# EAGLE design ledbar (EAGLE 5.11)
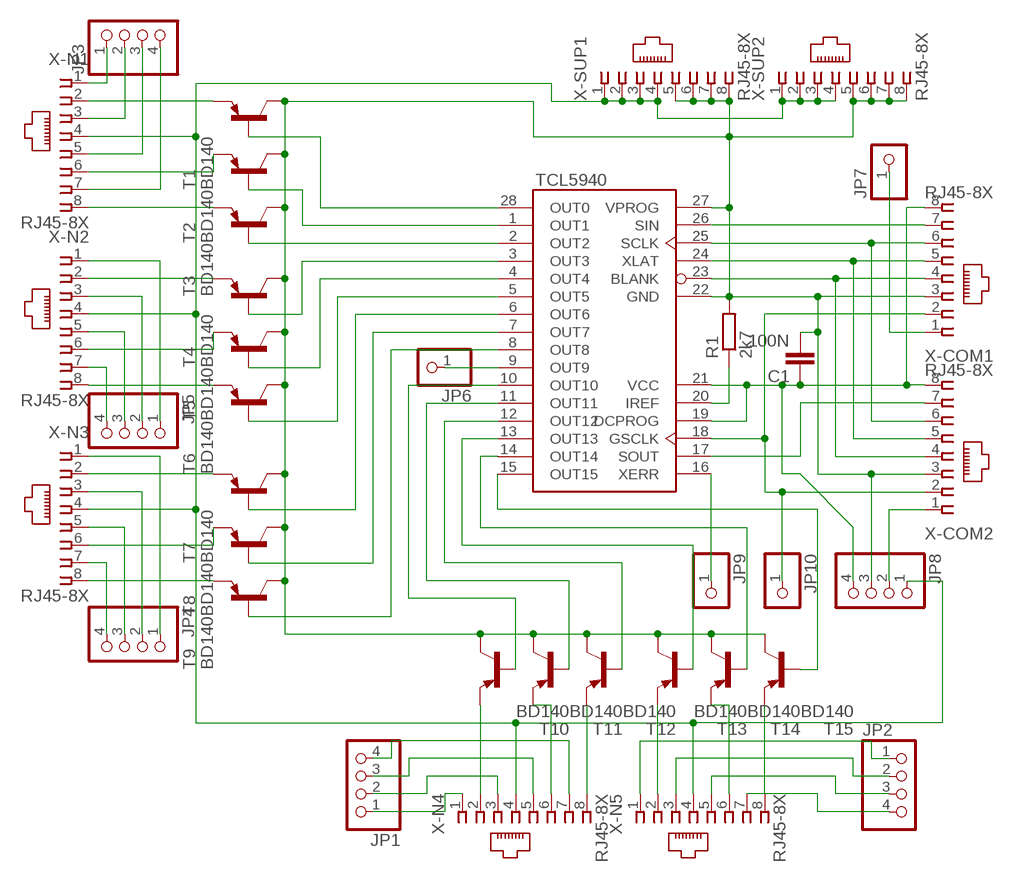
[diagram p0: schematic, sheet 1]

## Parts
C1  100N  C2.5/2  [C2.5-2]
IC1  TCL5940  [DIP28]
JP1  PINHD-1X4  [1X04]
JP2  PINHD-1X4  [1X04]
JP3  PINHD-1X4  [1X04]
JP4  PINHD-1X4  [1X04]
JP5  PINHD-1X4  [1X04]
JP6  PINHD-1X1  [1X01]
JP7  PINHD-1X1  [1X01]
JP8  PINHD-1X4  [1X04]
JP9  PINHD-1X1  [1X01]
JP10  PINHD-1X1  [1X01]
R1  2k7  R-EU_0204/7  [0204/7]
T1  BD140  -PNP-TO126V  [TO126V]
T2  BD140  -PNP-TO126V  [TO126V]
T3  BD140  -PNP-TO126V  [TO126V]
T4  BD140  -PNP-TO126V  [TO126V]
T5  BD140  -PNP-TO126V  [TO126V]
T6  BD140  -PNP-TO126V  [TO126V]
T7  BD140  -PNP-TO126V  [TO126V]
T8  BD140  -PNP-TO126V  [TO126V]
T9  BD140  -PNP-TO126V  [TO126V]
T10  BD140  -PNP-TO126V  [TO126V]
T11  BD140  -PNP-TO126V  [TO126V]
T12  BD140  -PNP-TO126V  [TO126V]
T13  BD140  -PNP-TO126V  [TO126V]
T14  BD140  -PNP-TO126V  [TO126V]
T15  BD140  -PNP-TO126V  [TO126V]
X-COM1  RJ45-8X  [RJ45-NO-SHIELD]
X-COM2  RJ45-8X  [RJ45-NO-SHIELD]
X-N1  RJ45-8X  [RJ45-NO-SHIELD]
X-N2  RJ45-8X  [RJ45-NO-SHIELD]
X-N3  RJ45-8X  [RJ45-NO-SHIELD]
X-N4  RJ45-8X  [RJ45-NO-SHIELD]
X-N5  RJ45-8X  [RJ45-NO-SHIELD]
X-SUP1  RJ45-8X  [RJ45-NO-SHIELD]
X-SUP2  RJ45-8X  [RJ45-NO-SHIELD]

## Nets
GND: C1.2 IC1.22(GND) IC1.27(VPROG) JP8.3 R1.2 T1.2(C) T2.2(C) T3.2(C) T4.2(C) T5.2(C) T6.2(C) T7.2(C) T8.2(C) T9.2(C) T10.2(C) T11.2(C) T12.2(C) T13.2(C) T14.2(C) T15.2(C) X-COM1.3 X-COM2.3 X-SUP1.5 X-SUP1.6 X-SUP1.7 X-SUP1.8 X-SUP2.5 X-SUP2.6 X-SUP2.7 X-SUP2.8
N$1: JP8.1 X-N1.4 X-N2.4 X-N3.4 X-N4.4 X-N5.4 X-SUP1.1 X-SUP1.2 X-SUP1.3 X-SUP1.4 X-SUP2.1 X-SUP2.2 X-SUP2.3 X-SUP2.4
N$2: IC1.28(OUT0) T1.3(B)
N$3: T1.1(E) X-N1.2
N$4: IC1.1(OUT1) T2.3(B)
N$5: IC1.26(SIN) X-COM1.7
N$6: IC1.2(OUT2) T3.3(B)
N$7: IC1.20(IREF) R1.1
N$8: IC1.25(SCLK) X-COM1.6 X-COM2.6
N$9: IC1.24(XLAT) X-COM1.5 X-COM2.5
N$10: IC1.23(BLANK) X-COM1.4 X-COM2.4
N$11: IC1.18(GSCLK) JP10.1 X-COM1.2 X-COM2.2
N$12: C1.1 IC1.19(DCPROG) IC1.21(VCC) JP8.4 X-COM1.8 X-COM2.8
N$13: IC1.3(OUT3) T4.3(B)
N$14: IC1.17(SOUT) X-COM2.7
N$15: T6.1(E) X-N2.8
N$16: T9.1(E) X-N3.8
N$17: IC1.4(OUT4) T5.3(B)
N$18: T10.1(E) X-N4.2
N$19: JP8.2 X-COM2.1
N$20: T4.1(E) X-N2.2
N$21: IC1.5(OUT5) T6.3(B)
N$22: JP1.1 X-N4.1
N$23: JP1.2 X-N4.3
N$24: T7.1(E) X-N3.2
N$25: IC1.6(OUT6) T7.3(B)
N$26: IC1.7(OUT7) T8.3(B)
N$27: IC1.8(OUT8) T9.3(B)
N$28: T3.1(E) X-N1.8
N$29: JP1.3 X-N4.5
N$30: JP1.4 X-N4.7
N$31: T12.1(E) X-N4.8
N$32: T2.1(E) X-N1.6
N$33: JP2.4 X-N5.7
N$34: JP2.3 X-N5.5
N$35: T15.1(E) X-N5.8
N$36: IC1.15(OUT15) T15.3(B)
N$37: IC1.14(OUT14) T14.3(B)
N$38: IC1.13(OUT13) T13.3(B)
N$39: IC1.12(OUT12) T12.3(B)
N$40: IC1.11(OUT11) T11.3(B)
N$41: IC1.10(OUT10) T10.3(B)
N$42: JP2.2 X-N5.3
N$43: T5.1(E) X-N2.6
N$44: T14.1(E) X-N5.6
N$45: JP4.1 X-N3.1
N$46: JP4.2 X-N3.3
N$47: T8.1(E) X-N3.6
N$48: JP4.3 X-N3.5
N$49: JP4.4 X-N3.7
N$50: T11.1(E) X-N4.6
N$51: JP5.1 X-N2.1
N$52: JP5.2 X-N2.3
N$53: T13.1(E) X-N5.2
N$54: JP5.3 X-N2.5
N$55: JP5.4 X-N2.7
N$56: JP3.1 X-N1.1
N$57: JP3.2 X-N1.3
N$58: JP3.3 X-N1.5
N$59: JP3.4 X-N1.7
N$60: JP2.1 X-N5.1
N$61: IC1.9(OUT9) JP6.1
N$62: JP7.1 X-COM1.1
N$63: IC1.16(XERR) JP9.1

## Library data of the parts
C1 = capacitor-wima:C: CAPACITOR naming: grid - package width
IC1 = tcl5940:TCL5940: 16-Channel 12-Bit LED Driver
JP1-JP5 JP8 = pinhead:PINHD-1X4: PIN HEADER
JP6 JP7 JP9 JP10 = pinhead:PINHD-1X1: PIN HEADER
R1 = resistor:R-EU_: RESISTOR, European symbol
T1-T15 = transistor:*-PNP-: PNP Transistror
X-COM1 X-COM2 X-N1-X-N5 X-SUP1 X-SUP2 = con-tycoelectronics:RJ45: CORCOM Modular RJ Jacks No Shield Source: www.tycoelectronics.com .. ENG_DS_1654001_1099_RJ_L_0507.pdf

## Board
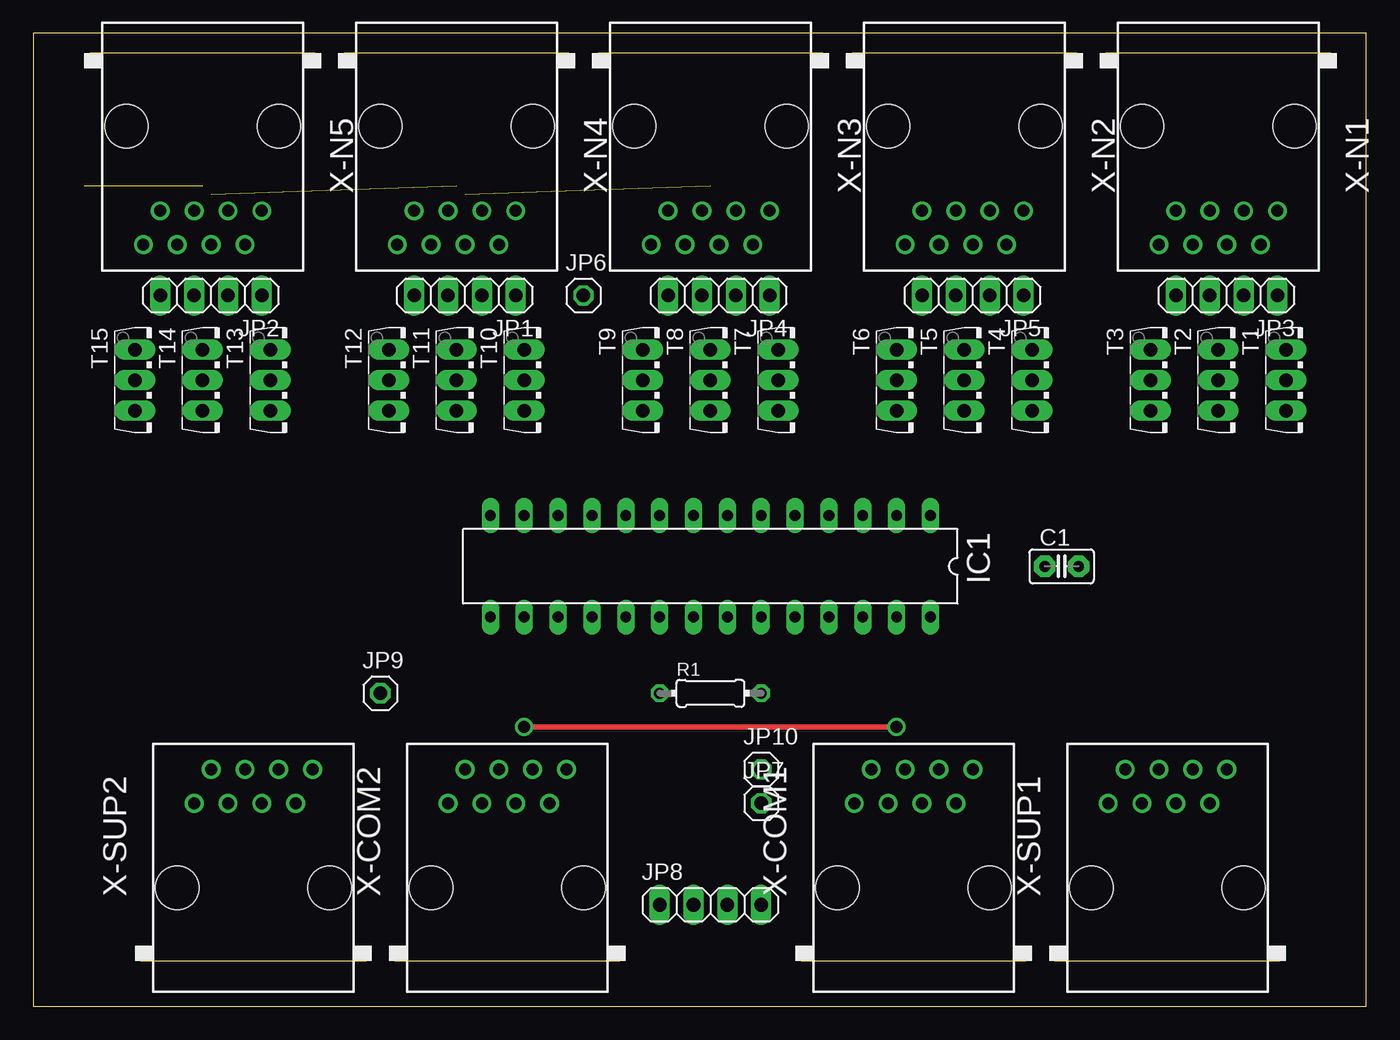
[diagram p1: board, top side]
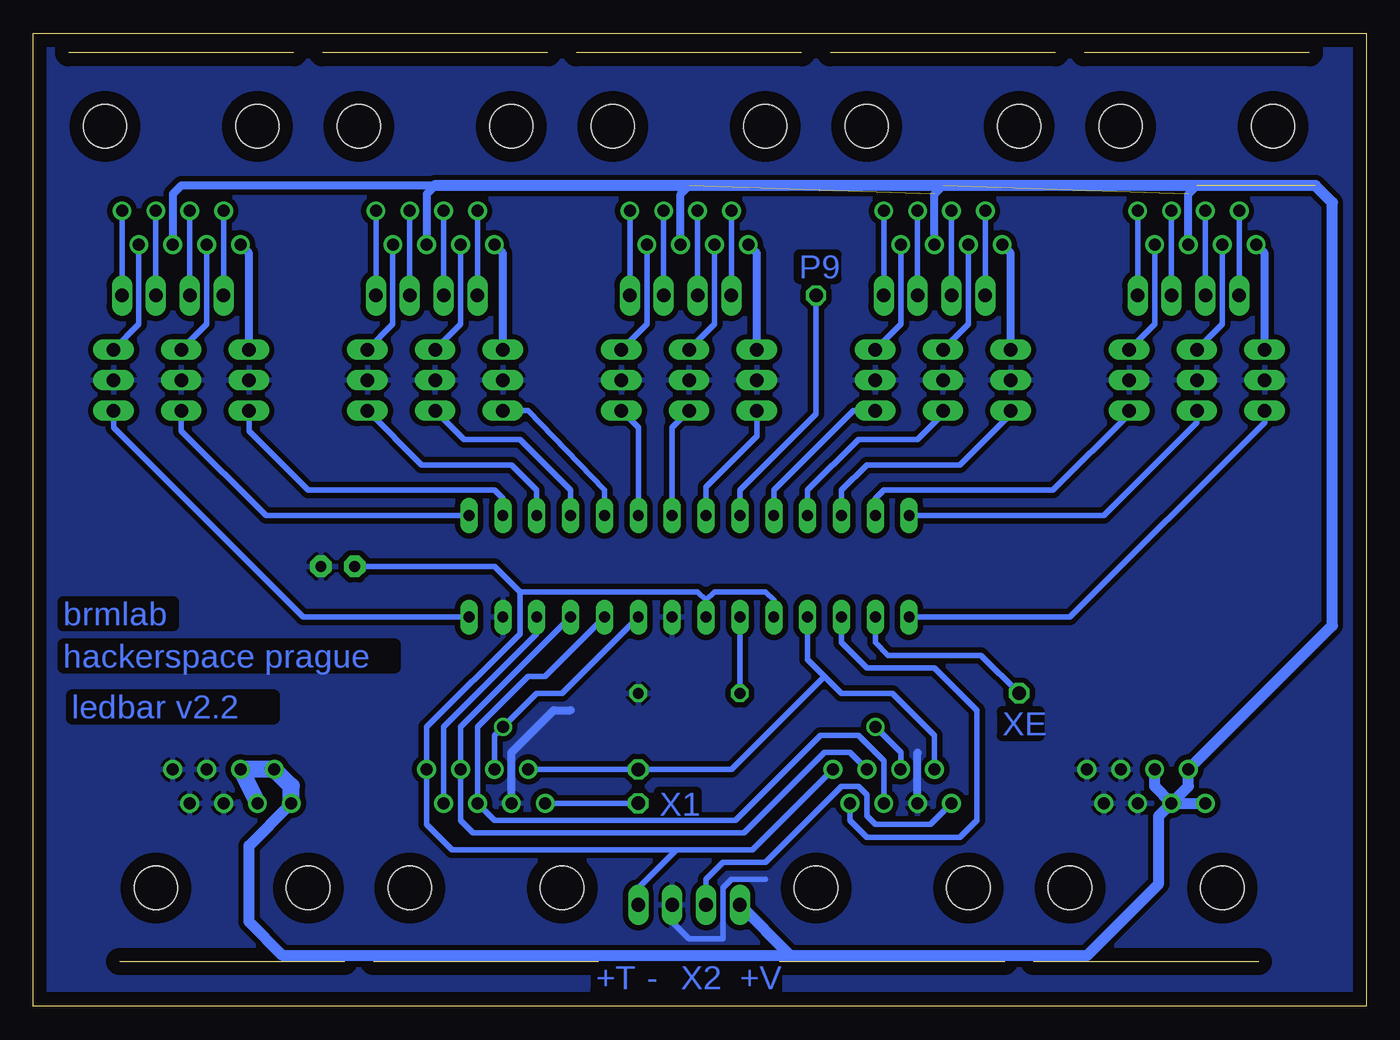
[diagram p2: board, bottom side, seen from below]

Size 100 x 73.02 mm. Coordinates in mm from the lower left corner, seen from the top.
Outline: 0,0 100,0 100,73.02 0,73.02 0,0
Copper layers (1*16): Top 0.035mm / dielectric 1.5mm / Bottom 0.035mm
Design rules "default *": minimum track width 10mil, minimum drill 24mil, track to track 16mil, track to pad 16mil, pad to pad 16mil, via to via 16mil, smd to smd 8mil, copper to edge 40mil, drill to drill 8mil, minimum pad ring 10mil, minimum via ring 8mil, stop-mask expansion 4mil, vias tented up to drill 0mil, thermal gap 10mil

### Footprints (pad centres in the part's own frame; a part is rotated, then mirrored left to right if it is on the bottom)
C2.5-2 = drill 0.813 pad 1.6 octagon: 1 -1.27,0; 2 1.27,0
DIP28 = drill 0.813 long: 1 -15.24,-3.81; 2 -12.7,-3.81; 3 -10.16,-3.81; 4 -7.62,-3.81; 5 -5.08,-3.81; 6 -2.54,-3.81; 7 0,-3.81; 8 2.54,-3.81; 9 5.08,-3.81; 10 7.62,-3.81; 11 10.16,-3.81; 12 12.7,-3.81; 13 15.24,-3.81; 14 17.78,-3.81; 15 17.78,3.81; 16 15.24,3.81; 17 12.7,3.81; 18 10.16,3.81; 19 7.62,3.81; 20 5.08,3.81; 21 2.54,3.81; 22 0,3.81; 23 -2.54,3.81; 24 -5.08,3.81; 25 -7.62,3.81; 26 -10.16,3.81; 27 -12.7,3.81; 28 -15.24,3.81
1X04 = drill 1.016 long: 1 -3.81,0; 2 -1.27,0; 3 1.27,0; 4 3.81,0
1X01 = drill 1.016 octagon: 1 0,0
0204/7 = drill 0.813 octagon: 1 -3.81,0; 2 3.81,0
TO126V = drill 1.016 long: 1 -2.286,-1.27; 2 0,-1.27; 3 2.286,-1.27
RJ45-NO-SHIELD = drill 0.9 pad 1.4 round: 1 -4.445,6.35; 2 -3.175,8.89; 3 -1.905,6.35; 4 -0.635,8.89; 5 0.635,6.35; 6 1.905,8.89; 7 3.175,6.35; 8 4.445,8.89 | hole 3.251: -5.715,0; 5.715,0

### Placement (x,y rotation side)
C1  77.15,33.02 0 top
IC1  52.07,33.02 180 top
JP1  32.38,53.34 180 top
JP2  13.34,53.34 180 top
JP3  89.53,53.34 180 top
JP4  51.44,53.34 180 top
JP5  70.48,53.34 180 top
JP6  41.27,53.34 0 top
JP7  54.61,15.24 0 top
JP8  50.8,7.62 0 top
JP9  26.04,23.49 0 top
JP10  54.61,17.78 0 top
R1  50.8,23.49 0 top
T1  95.25,46.99 270 top
T2  90.17,46.99 270 top
T3  85.09,46.99 270 top
T4  76.2,46.99 270 top
T5  71.12,46.99 270 top
T6  66.04,46.99 270 top
T7  57.15,46.99 270 top
T8  52.07,46.99 270 top
T9  46.99,46.99 270 top
T10  38.1,46.99 270 top
T11  33.02,46.99 270 top
T12  27.94,46.99 270 top
T13  19.05,46.99 270 top
T14  13.97,46.99 270 top
T15  8.89,46.99 270 top
X-COM1  66.04,8.89 0 top
X-COM2  35.56,8.89 0 top
X-N1  88.9,66.04 180 top
X-N2  69.85,66.04 180 top
X-N3  50.8,66.04 180 top
X-N4  31.75,66.04 180 top
X-N5  12.7,66.04 180 top
X-SUP1  85.09,8.89 0 top
X-SUP2  16.51,8.89 0 top

### Tracks (layer width: path | path; a pad name or v marks a point on that pad's centre or on a via)
GND
  Bottom 0.406: JP8.3 52.07,6.35 50.8,5.08 48.26,5.08 48.26,8.89 47.62,9.53 45.09,9.53
  Bottom 0.61: X-COM1.3 64.14,19.05 60.96,22.23 59.69,22.23 | X-COM2.3 33.66,19.05
  pour Bottom: 0,72.39 100.33,72.39 100.33,1.27 0,1.27
N$1  (3 unrouted)
  Bottom 0.61: X-N1.4 89.53,60.96 88.9,61.59 69.85,61.59 70.48,60.96 X-N2.4 | X-N3.4 51.44,60.96 50.8,61.59 | X-N4.4 32.38,60.96 31.75,61.59 | X-N5.4 13.34,60.96 12.7,61.59
  Bottom 0.813: X-SUP2.4 15.88,16.51 X-SUP2.3 | X-SUP2.3 X-SUP2.1 | 43.18,3.81 20.95,3.81 15.56,9.21 15.56,14.29 X-SUP2.3 | 69.85,61.59 3.81,61.59 2.54,60.33 2.54,28.58 X-SUP2.2 13.34,16.51 X-SUP2.3 | X-SUP1.1 83.82,12.06 83.82,6.35 81.28,3.81 43.18,3.81 | 43.18,3.81 JP8.1
  Bottom 1.27: X-SUP1.1 80.64,16.51 X-SUP1.2 X-SUP1.4 X-SUP1.3
N$2
  Bottom 0.406: IC1.28 79.76,29.21 93.98,43.43 T1.3
N$3
  Bottom 0.406: X-N1.2 92.08,51.18 T1.1
N$4
  Bottom 0.406: T2.3 88.9,43.18 82.55,36.83 IC1.1
N$5
  Bottom 0.406: X-COM1.7 69.22,20.95 62.23,27.94 IC1.26
N$6
  Bottom 0.406: T3.3 83.82,43.18 79.38,38.73 65.41,38.73 64.77,38.1 IC1.2
N$7
  Bottom 0.406: R1.1 IC1.20
N$8
  Bottom 0.406: X-COM2.6 38.73,19.05 40.64,19.05 46.67,13.02 66.99,13.02 67.94,13.97 X-COM1.6 67.94,20.95 IC1.25
N$9
  Bottom 0.406: X-COM2.5 36.2,18.41 38.1,20.32 40.96,20.32 47.31,13.97 65.41,13.97 X-COM1.5 66.67,20.95 62.87,24.77 61.59,24.77 IC1.24
N$10  (via drill 0.9)
  Top 0.406: v36.83,20.95 v64.77,20.95
  Bottom 0.406: X-COM1.4 65.41,20.32 v64.77,20.95 62.23,23.49 60.33,23.49 IC1.23 | X-COM2.4 34.92,19.05 v36.83,20.95
N$11
  Bottom 0.406: X-COM1.2 JP10.1 47.62,17.78 40.64,24.77 | 40.64,24.77 41.91,26.03 IC1.18 | X-COM2.2 32.38,20.32 35.56,23.49 39.37,23.49 40.64,24.77
N$12
  Bottom 0.406: 63.5,31.12 50.16,31.12 49.53,30.48 | X-COM2.8 46.04,11.75 51.75,11.75 | JP8.4 54.61,8.89 51.75,11.75 | 51.75,11.75 68.58,11.75 70.48,13.65 X-COM1.8 70.48,20.95 63.5,27.94 63.5,31.12 | C1.1 65.41,33.02 63.5,31.12 | IC1.19 44.45,30.48 45.09,31.12 48.9,31.12 49.53,30.48 | 49.53,30.48 IC1.21
N$13
  Bottom 0.406: IC1.3 62.23,38.73 64.14,40.64 70.87,40.64 T4.3
N$14
  Bottom 0.406: IC1.17 39.37,27.3 37.47,25.4 32.38,25.4 29.21,22.23 29.21,13.97 30.48,12.7 37.47,12.7 38.73,13.97 X-COM2.7
N$15
  Bottom 0.61: T6.1 64.77,56.52 X-N2.8
N$16
  Bottom 0.61: T9.1 45.72,56.52 X-N3.8
N$17
  Bottom 0.406: IC1.4 59.69,38.73 63.5,42.55 67.69,42.55 T5.3
N$18
  Bottom 0.406: X-N4.2 34.92,51.18 T10.1
N$19
  Bottom 0.406: X-COM2.1 32.7,13.65 36.83,13.65 37.47,14.29 37.47,15.87 38.1,16.51 39.37,16.51 45.09,10.79 48.26,10.79 49.53,9.53 JP8.2
N$20
  Bottom 0.406: X-N2.2 73.03,51.18 T4.1
N$21
  Bottom 0.406: IC1.5 57.15,38.73 62.87,44.7 T6.3
N$22
  Bottom 0.406: JP1.1 X-N4.1
N$23
  Bottom 0.406: JP1.2 X-N4.3
N$24
  Bottom 0.406: X-N3.2 53.98,51.18 T7.1
N$25
  Bottom 0.406: IC1.6 54.61,43.43 T7.3
N$26
  Bottom 0.406: IC1.7 52.07,43.43 T8.3
N$27
  Bottom 0.406: IC1.8 49.53,38.99 45.72,42.8 T9.3
N$28
  Bottom 0.61: T3.1 83.82,56.52 X-N1.8
N$29
  Bottom 0.406: JP1.3 X-N4.5
N$30
  Bottom 0.406: JP1.4 X-N4.7
N$31
  Bottom 0.61: T12.1 26.67,56.52 X-N4.8
N$32
  Bottom 0.406: X-N1.6 87,51.18 T2.1
N$33
  Bottom 0.406: JP2.4 X-N5.7
N$34
  Bottom 0.406: JP2.3 X-N5.5
N$35
  Bottom 0.61: T15.1 7.62,56.52 X-N5.8
N$36
  Bottom 0.406: T15.3 7.62,43.82 22.23,29.21 IC1.15
N$37
  Bottom 0.406: T14.3 12.7,43.82 19.68,36.83 IC1.14
N$38
  Bottom 0.406: T13.3 17.78,44.45 23.5,38.73 36.2,38.73 36.83,38.1 IC1.13
N$39
  Bottom 0.406: IC1.12 39.37,38.73 37.47,40.64 30.48,40.64 26.67,44.45 T12.3
N$40
  Bottom 0.406: IC1.11 41.91,38.73 38.1,42.55 33.66,42.55 31.75,44.45 T11.3
N$41
  Bottom 0.406: IC1.10 44.45,38.73 38.48,44.7 T10.3
N$42
  Bottom 0.406: JP2.2 X-N5.3
N$43
  Bottom 0.406: X-N2.6 67.94,51.18 T5.1
N$44
  Bottom 0.406: X-N5.6 10.79,51.18 T14.1
N$45
  Bottom 0.406: JP4.1 X-N3.1
N$46
  Bottom 0.406: JP4.2 X-N3.3
N$47
  Bottom 0.406: X-N3.6 48.9,51.18 T8.1
N$48
  Bottom 0.406: JP4.3 X-N3.5
N$49
  Bottom 0.406: JP4.4 X-N3.7
N$50
  Bottom 0.406: X-N4.6 29.84,51.18 T11.1
N$51
  Bottom 0.406: JP5.1 X-N2.1
N$52
  Bottom 0.406: JP5.2 X-N2.3
N$53
  Bottom 0.406: X-N5.2 15.88,51.18 T13.1
N$54
  Bottom 0.406: JP5.3 X-N2.5
N$55
  Bottom 0.406: JP5.4 X-N2.7
N$56
  Bottom 0.406: JP3.1 X-N1.1
N$57
  Bottom 0.406: JP3.2 X-N1.3
N$58
  Bottom 0.406: JP3.3 X-N1.5
N$59
  Bottom 0.406: JP3.4 X-N1.7
N$60
  Bottom 0.406: JP2.1 X-N5.1
N$61
  Bottom 0.406: IC1.9 46.99,38.73 41.27,44.45 JP6.1
N$62
  Bottom 0.406: JP7.1 X-COM1.1
N$63
  Bottom 0.406: IC1.16 36.83,27.3 35.88,26.35 28.89,26.35 JP9.1

### Text on the board
Bottom: P9 | brmlab | hackerspace prague | ledbar v2.2 | XE | X1 | +V | X2 | - | +T